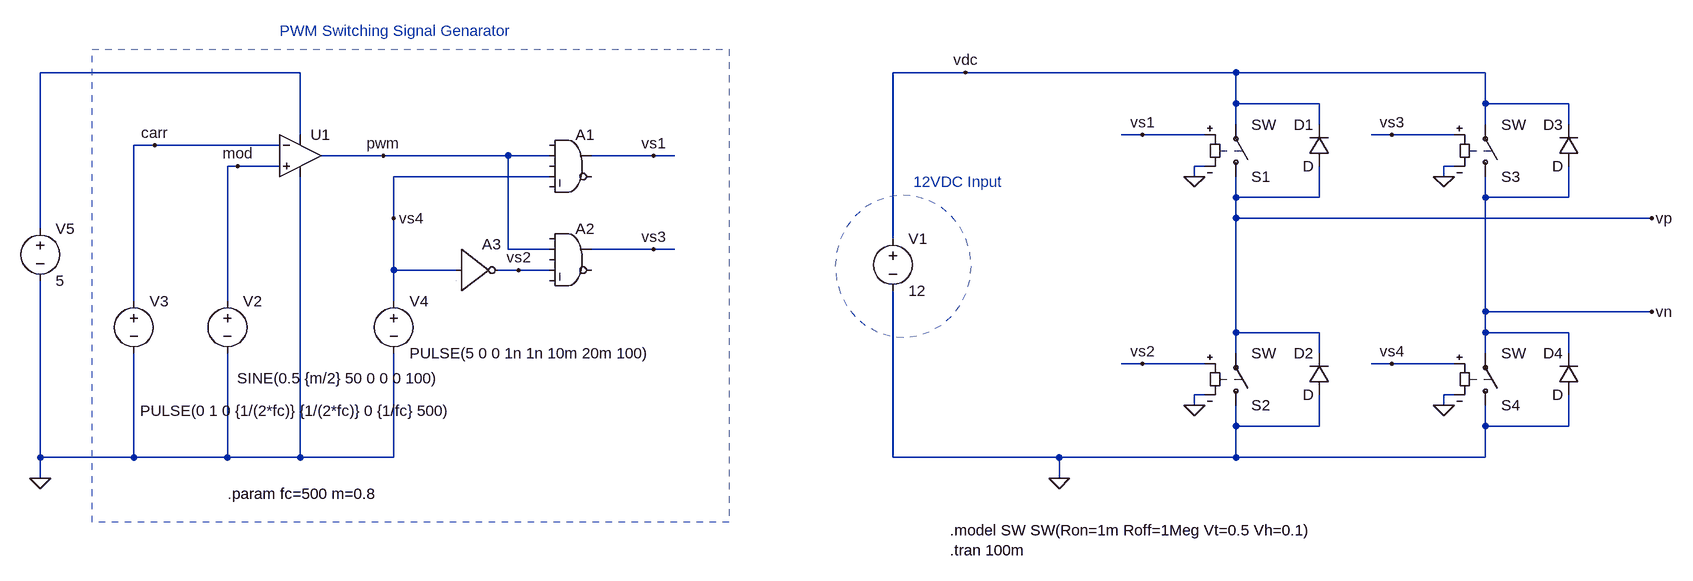
[diagram p0: schematic single-phase-inverter_v2p0.asc]
single-phase-inverter_v2p0.asc, the LTspice schematic file:
Version 4
SHEET 1 2224 844
WIRE -1248 96 -1648 96
WIRE -224 96 -336 96
WIRE 192 96 -224 96
WIRE 576 96 192 96
WIRE 192 144 192 96
WIRE 320 144 192 144
WIRE 576 144 576 96
WIRE 704 144 576 144
WIRE 192 176 192 144
WIRE 320 176 320 144
WIRE 576 176 576 144
WIRE 704 176 704 144
WIRE -1248 192 -1248 96
WIRE 48 192 16 192
WIRE 144 192 48 192
WIRE 432 192 400 192
WIRE 528 192 432 192
WIRE -1472 208 -1504 208
WIRE -1280 208 -1472 208
WIRE -1120 224 -1216 224
WIRE -928 224 -1120 224
WIRE -864 224 -928 224
WIRE -704 224 -800 224
WIRE -672 224 -704 224
WIRE -1344 240 -1360 240
WIRE -1280 240 -1344 240
WIRE 144 240 128 240
WIRE 528 240 512 240
WIRE -864 256 -1104 256
WIRE 128 256 128 240
WIRE 512 256 512 240
WIRE 192 288 192 256
WIRE 320 288 320 240
WIRE 320 288 192 288
WIRE 576 288 576 256
WIRE 704 288 704 240
WIRE 704 288 576 288
WIRE -1104 320 -1104 256
WIRE 192 320 192 288
WIRE 832 320 192 320
WIRE -1648 336 -1648 96
WIRE -336 352 -336 96
WIRE -928 368 -928 224
WIRE -864 368 -928 368
WIRE -704 368 -800 368
WIRE -672 368 -704 368
WIRE -1104 400 -1104 320
WIRE -1008 400 -1104 400
WIRE -912 400 -944 400
WIRE -864 400 -912 400
WIRE -1504 448 -1504 208
WIRE -1360 448 -1360 240
WIRE -1104 448 -1104 400
WIRE 576 464 576 288
WIRE 832 464 576 464
WIRE 192 496 192 320
WIRE 320 496 192 496
WIRE 576 496 576 464
WIRE 704 496 576 496
WIRE 192 528 192 496
WIRE 320 528 320 496
WIRE 576 528 576 496
WIRE 704 528 704 496
WIRE 48 544 16 544
WIRE 144 544 48 544
WIRE 432 544 400 544
WIRE 528 544 432 544
WIRE 144 592 128 592
WIRE 528 592 512 592
WIRE 128 608 128 592
WIRE 512 608 512 592
WIRE 192 640 192 608
WIRE 320 640 320 592
WIRE 320 640 192 640
WIRE 576 640 576 608
WIRE 704 640 704 592
WIRE 704 640 576 640
WIRE -1648 688 -1648 416
WIRE -1504 688 -1504 528
WIRE -1504 688 -1648 688
WIRE -1360 688 -1360 528
WIRE -1360 688 -1504 688
WIRE -1248 688 -1248 256
WIRE -1248 688 -1360 688
WIRE -1104 688 -1104 528
WIRE -1104 688 -1248 688
WIRE -336 688 -336 432
WIRE -80 688 -336 688
WIRE 192 688 192 640
WIRE 192 688 -80 688
WIRE 576 688 576 640
WIRE 576 688 192 688
WIRE -1648 720 -1648 688
WIRE -80 720 -80 688
FLAG 512 256 0
FLAG 512 608 0
FLAG 128 608 0
FLAG 128 256 0
FLAG 48 192 vs1
FLAG 48 544 vs2
FLAG 432 192 vs3
FLAG 432 544 vs4
FLAG -80 720 0
FLAG 832 320 vp
FLAG 832 464 vn
FLAG -224 96 vdc
FLAG -1472 208 carr
FLAG -1344 240 mod
FLAG -1120 224 pwm
FLAG -1104 320 vs4
FLAG -912 400 vs2
FLAG -704 224 vs1
FLAG -704 368 vs3
FLAG -1648 720 0
SYMBOL sw 192 272 M180
SYMATTR InstName S1
SYMBOL sw 192 624 M180
SYMATTR InstName S2
SYMBOL sw 576 272 M180
SYMATTR InstName S3
SYMBOL sw 576 624 M180
SYMATTR InstName S4
SYMBOL voltage -336 336 R0
SYMATTR InstName V1
SYMATTR Value 12
SYMBOL inv -1008 336 R0
SYMATTR InstName A3
SYMATTR SpiceLine VHIGH=5
SYMBOL voltage -1360 432 R0
WINDOW 3 15 134 Left 2
SYMATTR Value SINE(0.5 {m/2} 50 0 0 0 100)
SYMATTR InstName V2
SYMBOL voltage -1504 432 R0
WINDOW 3 10 184 Left 2
SYMATTR Value PULSE(0 1 0 {1/(2*fc)} {1/(2*fc)} 0 {1/fc} 500)
SYMATTR InstName V3
SYMBOL voltage -1104 432 R0
SYMATTR InstName V4
SYMATTR Value PULSE(5 0 0 1n 1n 10m 20m 100)
SYMBOL OpAmps/UniversalOpAmp2 -1248 224 R0
SYMATTR InstName U1
SYMATTR SpiceLine Ilimit=25m Rail=1 Vos=0
SYMBOL Digital/and -832 176 R0
SYMATTR InstName A1
SYMATTR SpiceLine VHIGH=5
SYMBOL Digital/and -832 320 R0
SYMATTR InstName A2
SYMATTR SpiceLine VHIGH=5
SYMBOL voltage -1648 320 R0
SYMATTR InstName V5
SYMATTR Value 5
SYMATTR SpiceLine Rser=1m
SYMBOL diode 336 240 R180
WINDOW 0 24 64 Left 2
WINDOW 3 24 0 Left 2
SYMATTR InstName D1
SYMBOL diode 336 592 R180
WINDOW 0 24 64 Left 2
WINDOW 3 24 0 Left 2
SYMATTR InstName D2
SYMBOL diode 720 240 R180
WINDOW 0 24 64 Left 2
WINDOW 3 24 0 Left 2
SYMATTR InstName D3
SYMBOL diode 720 592 R180
WINDOW 0 24 64 Left 2
WINDOW 3 24 0 Left 2
SYMATTR InstName D4
TEXT -248 800 Left 2 !.model SW SW(Ron=1m Roff=1Meg Vt=0.5 Vh=0.1)\n.tran 100m
TEXT -1360 744 Left 2 !.param fc=500 m=0.8
TEXT -1280 32 Left 2 ;PWM Switching Signal Genarator
TEXT -304 264 Left 2 ;12VDC Input
RECTANGLE Normal -1568 60 -588 788 3
CIRCLE Normal -424 284 -216 504 3

The netlist it stands for:
* single-phase-inverter_v2p0.asc
S1 vp vdc vs1 0 SW
S2 0 vp vs2 0 SW
S3 vn vdc vs3 0 SW
S4 0 vn vs4 0 SW
V1 vdc 0 12
A3 vs4 0 0 0 0 vs2 0 0 BUF VHIGH=5
V2 mod 0 SINE(0.5 {m/2} 50 0 0 0 100)
V3 carr 0 PULSE(0 1 0 {1/(2*fc)} {1/(2*fc)} 0 {1/fc} 500)
V4 vs4 0 PULSE(5 0 0 1n 1n 10m 20m 100)
XU1 mod carr N001 0 pwm level2 Avol=1Meg GBW=10Meg Slew=10Meg Ilimit=25m Rail=1 Vos=0 En=0 Enk=0 In=0 Ink=0 Rin=500Meg  ; pins In+ In- V+ V- OUT
A1 0 pwm 0 vs4 0 0 vs1 0 AND VHIGH=5
A2 0 pwm 0 vs2 0 0 vs3 0 AND VHIGH=5
V5 N001 0 5 Rser=1m
D1 vp vdc D
D2 0 vp D
D3 vn vdc D
D4 0 vn D
.model D D
.lib standard.dio
.model SW SW(Ron=1m Roff=1Meg Vt=0.5 Vh=0.1)
.tran 100m
.param fc=500 m=0.8
* PWM Switching Signal Genarator
* 12VDC Input
.lib UniversalOpAmp2.lib
.backanno
.end